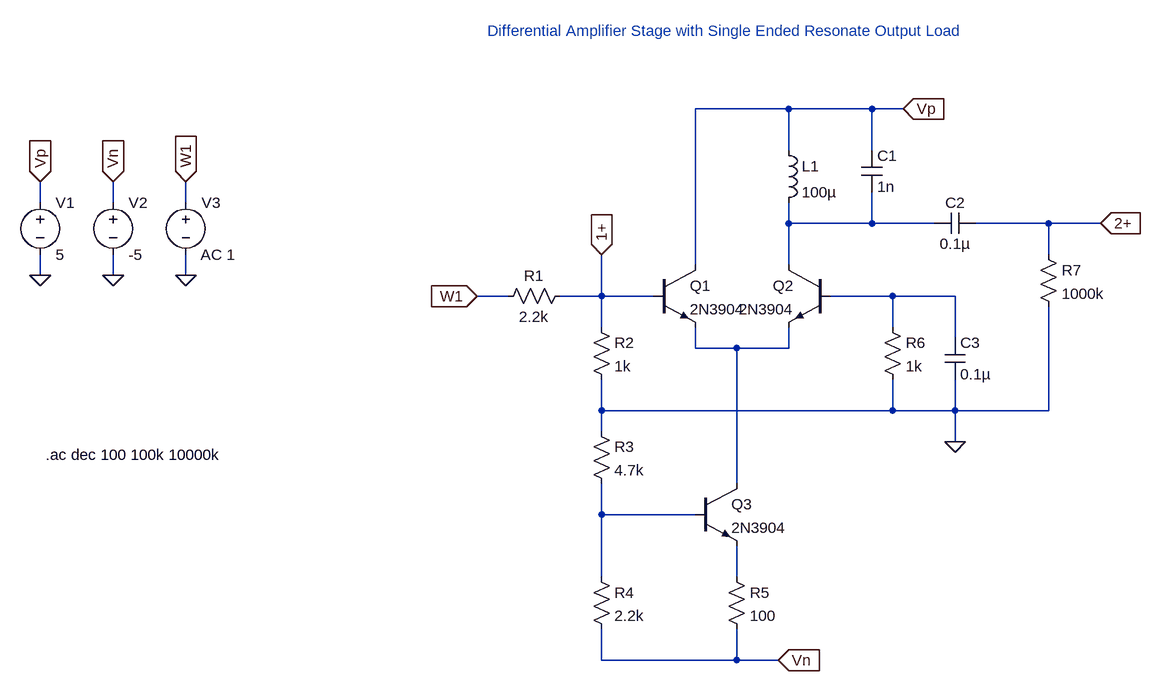
[diagram p0: schematic diff_amp_stage_single_ended_load_ltspice.asc]
diff_amp_stage_single_ended_load_ltspice.asc, the LTspice schematic file:
Version 4
SHEET 1 996 792
WIRE 352 -128 208 -128
WIRE 480 -128 352 -128
WIRE 528 -128 480 -128
WIRE 352 -64 352 -128
WIRE 480 -64 480 -128
WIRE -800 16 -800 -16
WIRE -688 16 -688 -16
WIRE -576 16 -576 -16
WIRE 352 48 352 16
WIRE 480 48 480 0
WIRE 480 48 352 48
WIRE 576 48 480 48
WIRE 752 48 640 48
WIRE 832 48 752 48
WIRE 752 96 752 48
WIRE 208 112 208 -128
WIRE 352 112 352 48
WIRE -800 128 -800 96
WIRE -688 128 -688 96
WIRE -576 128 -576 96
WIRE -80 160 -128 160
WIRE 64 160 64 96
WIRE 64 160 0 160
WIRE 144 160 64 160
WIRE 512 160 416 160
WIRE 608 160 512 160
WIRE 64 208 64 160
WIRE 512 208 512 160
WIRE 608 224 608 160
WIRE 208 240 208 208
WIRE 272 240 208 240
WIRE 352 240 352 208
WIRE 352 240 272 240
WIRE 64 336 64 288
WIRE 512 336 512 288
WIRE 512 336 64 336
WIRE 608 336 608 288
WIRE 608 336 512 336
WIRE 752 336 752 176
WIRE 752 336 608 336
WIRE 64 368 64 336
WIRE 608 384 608 336
WIRE 272 448 272 240
WIRE 64 496 64 448
WIRE 208 496 64 496
WIRE 64 592 64 496
WIRE 272 592 272 544
WIRE 64 720 64 672
WIRE 272 720 272 672
WIRE 272 720 64 720
WIRE 336 720 272 720
FLAG -800 128 0
FLAG -688 128 0
FLAG -576 128 0
FLAG -800 -16 Vp
IOPIN -800 -16 In
FLAG -688 -16 Vn
IOPIN -688 -16 In
FLAG -576 -16 W1
IOPIN -576 -16 In
FLAG 608 384 0
FLAG 528 -128 Vp
IOPIN 528 -128 In
FLAG 336 720 Vn
IOPIN 336 720 In
FLAG 832 48 2+
IOPIN 832 48 In
FLAG 64 96 1+
IOPIN 64 96 In
FLAG -128 160 W1
IOPIN -128 160 In
SYMBOL voltage -800 0 R0
WINDOW 123 0 0 Left 0
WINDOW 39 0 0 Left 0
SYMATTR InstName V1
SYMATTR Value 5
SYMBOL voltage -688 0 R0
WINDOW 123 0 0 Left 0
WINDOW 39 0 0 Left 0
SYMATTR InstName V2
SYMATTR Value -5
SYMBOL voltage -576 0 R0
WINDOW 123 23 96 Left 2
WINDOW 39 0 0 Left 0
SYMATTR InstName V3
SYMATTR Value ""
SYMATTR Value2 AC 1
SYMBOL res 16 144 R90
WINDOW 0 0 56 VBottom 2
WINDOW 3 32 56 VTop 2
SYMATTR InstName R1
SYMATTR Value 2.2k
SYMBOL npn 144 112 R0
SYMATTR InstName Q1
SYMATTR Value 2N3904
SYMBOL npn 416 112 M0
SYMATTR InstName Q2
SYMATTR Value 2N3904
SYMBOL res 48 192 R0
SYMATTR InstName R2
SYMATTR Value 1k
SYMBOL res 48 352 R0
SYMATTR InstName R3
SYMATTR Value 4.7k
SYMBOL res 48 576 R0
SYMATTR InstName R4
SYMATTR Value 2.2k
SYMBOL npn 208 448 R0
SYMATTR InstName Q3
SYMATTR Value 2N3904
SYMBOL res 256 576 R0
SYMATTR InstName R5
SYMATTR Value 100
SYMBOL res 496 192 R0
SYMATTR InstName R6
SYMATTR Value 1k
SYMBOL res 736 80 R0
SYMATTR InstName R7
SYMATTR Value 1000k
SYMBOL cap 464 -64 R0
SYMATTR InstName C1
SYMATTR Value 1n
SYMBOL cap 640 32 R90
WINDOW 0 0 32 VBottom 2
WINDOW 3 32 32 VTop 2
SYMATTR InstName C2
SYMATTR Value 0.1µ
SYMBOL ind 336 -80 R0
SYMATTR InstName L1
SYMATTR Value 100µ
SYMBOL cap 592 224 R0
SYMATTR InstName C3
SYMATTR Value 0.1µ
TEXT -792 404 Left 2 !.ac dec 100 100k 10000k
TEXT -112 -248 Left 2 ;Differential Amplifier Stage with Single Ended Resonate Output Load

The netlist it stands for:
* diff_amp_stage_single_ended_load_ltspice.asc
V1 Vp 0 5
V2 Vn 0 -5
V3 W1 0 AC 1
R1 1+ W1 2.2k
Q1 Vp 1+ N003 0 2N3904
Q2 N001 N002 N003 0 2N3904
R2 1+ 0 1k
R3 0 N004 4.7k
R4 N004 Vn 2.2k
Q3 N003 N004 N005 0 2N3904
R5 N005 Vn 100
R6 N002 0 1k
R7 2+ 0 1000k
C1 Vp N001 1n
C2 2+ N001 0.1µ
L1 Vp N001 100µ
C3 N002 0 0.1µ
.model NPN NPN
.model PNP PNP
.lib standard.bjt
.ac dec 100 100k 10000k
* Differential Amplifier Stage with Single Ended Resonate Output Load
.backanno
.end